# EAGLE design bitponics (EAGLE 6.4)
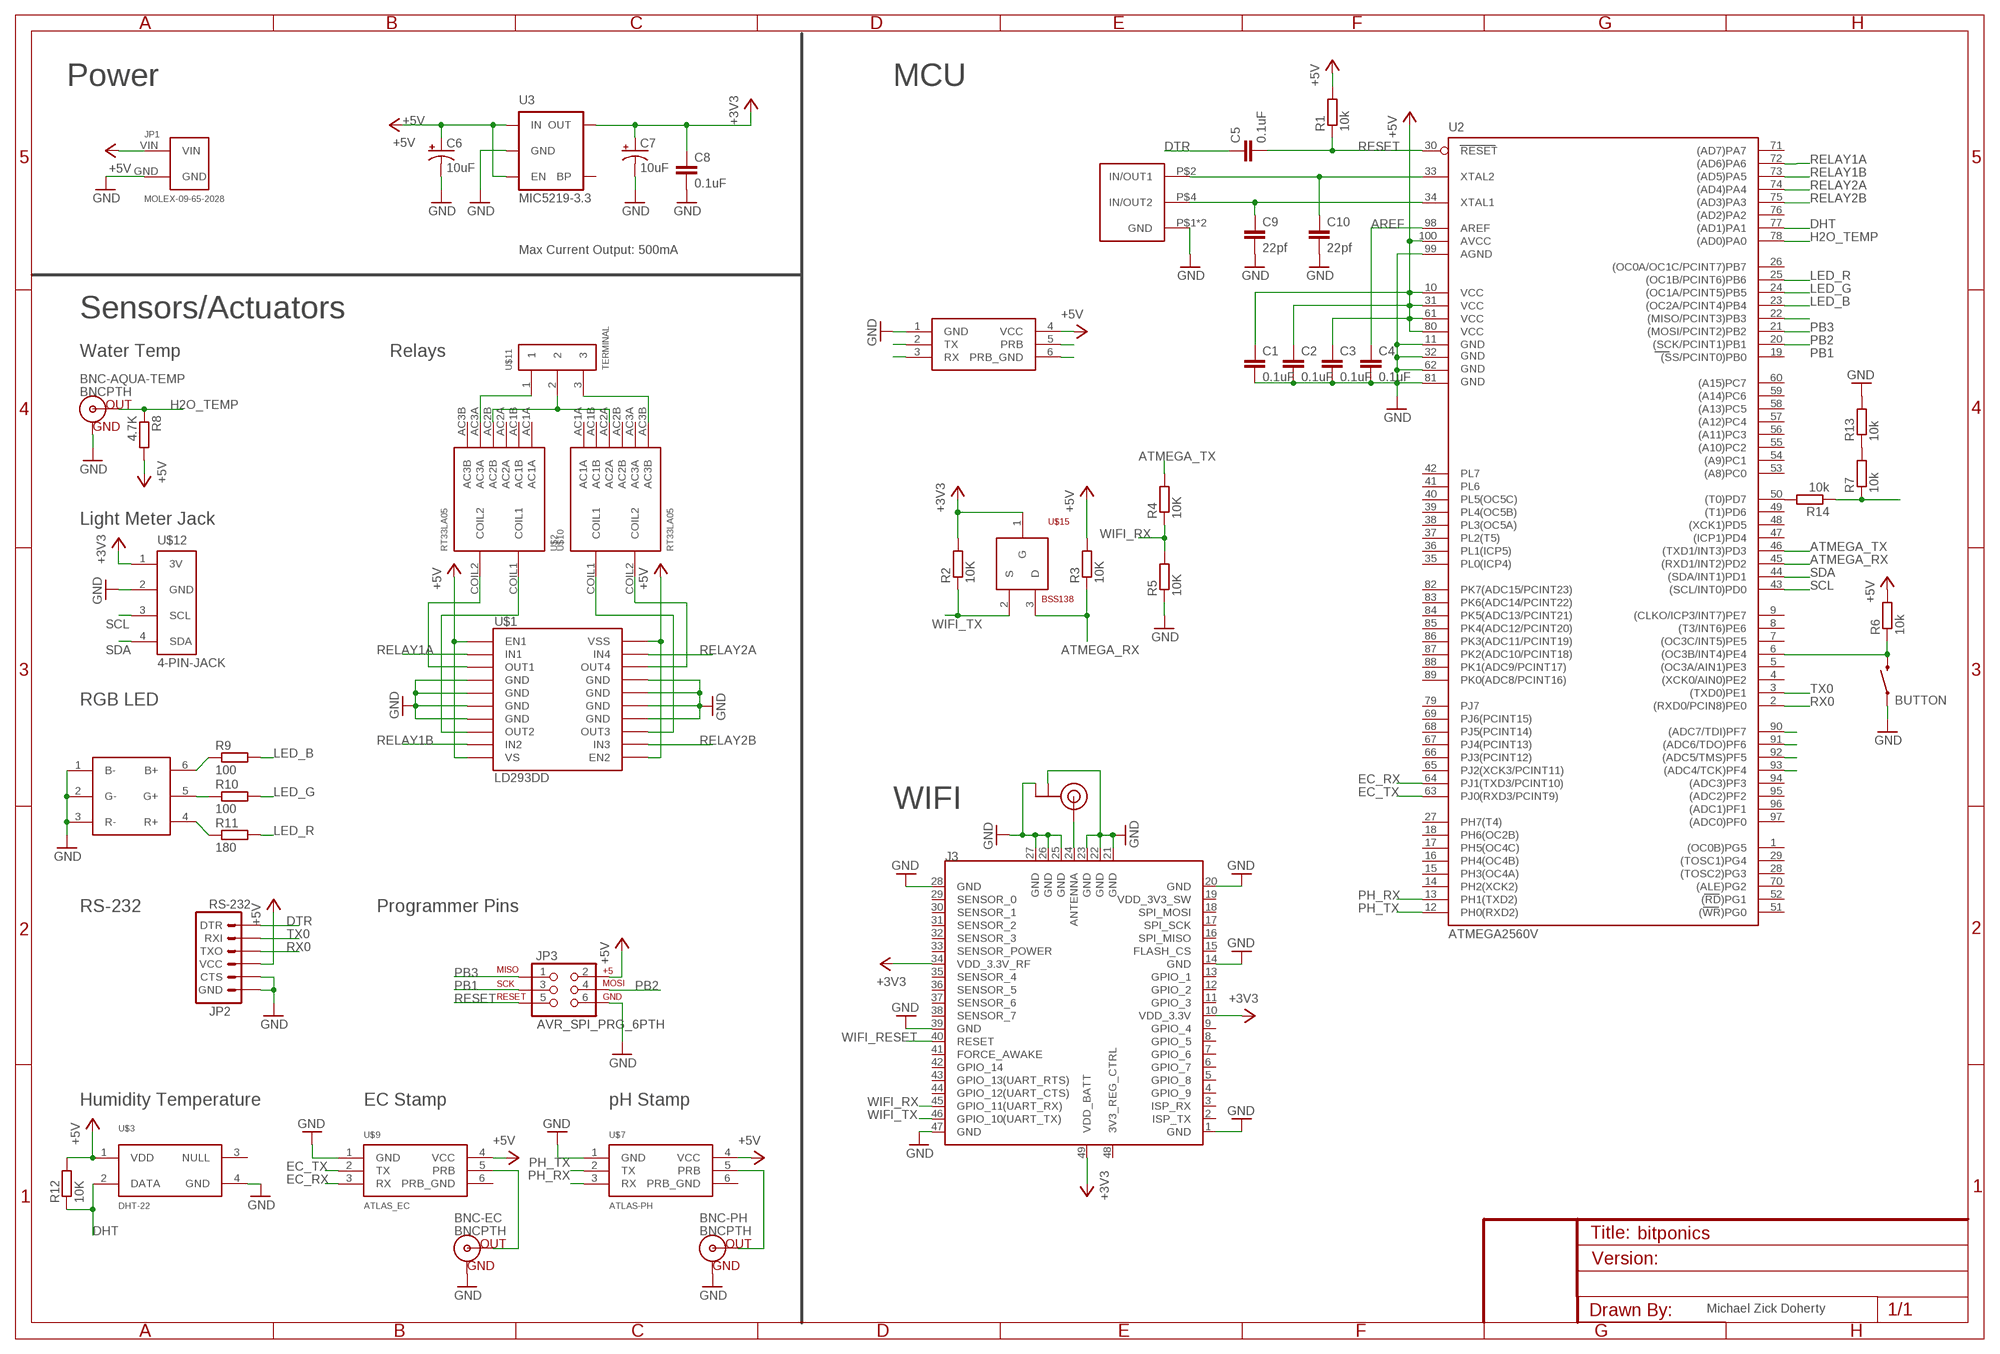
[diagram p0: schematic, sheet 1]

## Parts
BNC-AQUA-TEMP  BNCPTH  [BNC]
BNC-EC  BNCPTH  [BNC]
BNC-PH  BNCPTH  [BNC]
BUTTON  FSMRA2JH  [FSMRA2JH]
C1  0.1uF  C-EUC0603  [C0603]
C2  0.1uF  C-EUC0603  [C0603]
C3  0.1uF  C-EUC0603  [C0603]
C4  0.1uF  C-EUC0603  [C0603]
C5  0.1uF  C-EUC0603  [C0603]
C6  10uF  CAP_POL1206  [EIA3216]
C7  10uF  CAP_POL1206  [EIA3216]
C8  0.1uF  C-EUC0603  [C0603]
C9  22pf  C-EUC0603  [C0603]
C10  22pf  C-EUC0603  [C0603]
J3  WIFI-RN-171  [49P-1.27-26.67X17.78]
JP1  MOLEX-09-65-2028  [09-65-2028]
JP2  RS-232  ARDUINO_SERIAL_PROGRAMLOCK  [1X06_LOCK]
JP3  AVR_SPI_PRG_6PTH  [2X3]
R1  10k  R-EU_R0603  [R0603]
R2  10K  R-EU_R0603  [R0603]
R3  10K  R-EU_R0603  [R0603]
R4  10K  R-EU_R0603  [R0603]
R5  10K  R-EU_R0603  [R0603]
R6  10k  R-EU_R0603  [R0603]
R7  10k  R-EU_R0603  [R0603]
R8  4.7K  R-EU_R0603  [R0603]
R9  100  R-EU_R0603  [R0603]
R10  100  R-EU_R0603  [R0603]
R11  180  R-EU_R0603  [R0603]
R12  10K  R-EU_R0603  [R0603]
R13  10k  R-EU_R0603  [R0603]
R14  10k  R-EU_R0603  [R0603]
U2  ATMEGA2560AU  [TQFP100]
U3  V_REG_LDOSMD  [SOT23-5]
U13  RGB-LED  [RGB-LED]
U$1  LD293DD  [SO-20LD]
U$2  RT33LA05  [RT33LA05]
U$3  DHT-22  [DHT22]
U$4  ATLAS-PH  [PH]
U$5  U.FL  [U.FL]
U$6  ECX-32  [ECX-32]
U$7  ATLAS-PH  [PH]
U$9  ATLAS_EC  [EC]
U$10  RT33LA05  [RT33LA05]
U$11  TERMINAL  [TERMINAL]
U$12  4-PIN-JACK  [4-PIN-JACK]
U$15  BSS138  [SOT23]

## Nets
+3V3: C7.A(+) C8.1 J3.10(VDD_3.3V) J3.34(VDD_3.3V_RF) J3.49(VDD_BATT) R2.2 U3.5(OUT) U$12.1(3V) U$15.1(G)
+5V: C1.1 C2.1 C3.1 C6.A(+) JP1.VIN JP2.4(VCC) JP3.2 R1.2 R3.2 R6.2 R8.2 R12.2 U2.10(VCC) U2.31(VCC1) U2.61(VCC2) U2.80(VCC3) U2.100(AVCC) U3.1(IN) U3.3(EN) U$1.1(EN1) U$1.10(VS) U$1.11(EN2) U$1.20(VSS) U$3.1(VDD) U$4.4(VCC) U$7.4(VCC) U$9.4(VCC)
A4: U2.93((ADC4/TCK)PF4) U$4.5(PRB)
A5: U2.92((ADC5/TMS)PF5) U$4.6(PRB_GND)
A6: U2.91((ADC6/TDO)PF6) U$4.3(RX)
A7: U2.90((ADC7/TDI)PF7) U$4.2(TX)
AREF: C4.1 U2.98(AREF)
ATMEGA_RX: R3.1 U2.45((RXD1/INT2)PD2) U$15.3(D)
ATMEGA_TX: R4.2 U2.46((TXD1/INT3)PD3)
DHT: R12.1 U2.77((AD1)PA1) U$3.2(DATA)
DTR: C5.1 JP2.1(DTR)
EC_RX: U2.64(PJ1(TXD3/PCINT10)) U$9.3(RX)
EC_TX: U2.63(PJ0(RXD3/PCINT9)) U$9.2(TX)
GND: BNC-AQUA-TEMP.GND BNC-EC.GND BNC-PH.GND BUTTON.2A C1.2 C2.2 C3.2 C4.2 C6.C(-) C7.C(-) C8.2 C9.2 C10.2 J3.1(GND) J3.14(GND) J3.20(GND) J3.21(GND) J3.22(GND) J3.23(GND) J3.25(GND) J3.26(GND) J3.27(GND) J3.28(GND) J3.39(GND) J3.47(GND) JP1.GND JP2.5(CTS) JP2.6(GND) JP3.6 R5.1 R13.2 U2.11(GND) U2.32(GND1) U2.62(GND2) U2.81(GND3) U2.99(AGND) U3.2(GND) U13.1(B-) U13.2(G-) U13.3(R-) U$1.4(GND) U$1.5(GND) U$1.6(GND) U$1.7(GND) U$1.14(GND) U$1.15(GND) U$1.16(GND) U$1.17(GND) U$3.4(GND) U$4.1(GND) U$5.P$1(GND) U$5.P$2(GND) U$6.P$1(GND) U$6.P$3(GND) U$7.1(GND) U$9.1(GND) U$12.2(GND)
H2O_TEMP: BNC-AQUA-TEMP.S(OUT) R8.1 U2.78((AD0)PA0)
LED_B: R9.2 U2.23((OC2A/PCINT4)PB4)
LED_G: R10.2 U2.24((OC1A/PCINT5)PB5)
LED_R: R11.2 U2.25((OC1B/PCINT6)PB6)
N$1: BNC-EC.S(OUT) U$9.5(PRB)
N$2: BNC-PH.S(OUT) U$7.5(PRB)
N$3: U$1.13(OUT3) U$10.COIL1
N$4: U$2.AC3A U$11.1
N$5: U$2.AC2B U$10.AC2A U$11.2
N$6: U$10.AC3B U$11.3
N$7: C10.1 U2.33(XTAL2) U$6.P$2(IN/OUT1)
N$8: U$1.18(OUT4) U$10.COIL2
N$9: R10.1 U13.5(G+)
N$10: R11.1 U13.4(R+)
N$11: R9.1 U13.6(B+)
N$12: C9.1 U2.34(XTAL1) U$6.P$4(IN/OUT2)
N$13: J3.24(ANTENNA) U$5.P$3(SIGNAL)
N$16: U$1.3(OUT1) U$2.COIL2
N$17: U$1.8(OUT2) U$2.COIL1
N$18: R7.2 R13.1
N$19: R14.2 U2.50((T0)PD7)
N$22: BUTTON.2B R6.1 U2.6((OC3B/INT4)PE4)
PB1: JP3.3 U2.20((SCK/PCINT1)PB1)
PB2: JP3.4 U2.21((MOSI/PCINT2)PB2)
PB3: JP3.1 U2.22((MISO/PCINT3)PB3)
PH_RX: U2.13(PH1(TXD2)) U$7.3(RX)
PH_TX: U2.12(PH0(RXD2)) U$7.2(TX)
RELAY1A: U2.72((AD6)PA6) U$1.2(IN1)
RELAY1B: U2.73((AD5)PA5) U$1.9(IN2)
RELAY2A: U2.74((AD4)PA4) U$1.19(IN4)
RELAY2B: U2.75((AD3)PA3) U$1.12(IN3)
RESET: C5.2 JP3.5 R1.1 U2.30(RESET)
RX0: JP2.3(TXO) U2.2((RXD0/PCIN8)PE0)
SCL: U2.43((SCL/INT0)PD0) U$12.3(SCL)
SDA: U2.44((SDA/INT1)PD1) U$12.4(SDA)
TX0: JP2.2(RXI) U2.3((TXD0)PE1)
WIFI_RESET: J3.40(RESET) R7.1 R14.1
WIFI_RX: J3.45(GPIO_11(UART_RX)) R4.1 R5.2
WIFI_TX: J3.46(GPIO_10(UART_TX)) R2.1 U$15.2(S)
Unconnected: J3.2(ISP_TX) J3.3(ISP_RX) J3.4(GPIO_9) J3.5(GPIO_8) J3.6(GPIO_7) J3.7(GPIO_6) J3.8(GPIO_5) J3.9(GPIO_4) J3.11(GPIO_3) J3.12(GPIO_2) J3.13(GPIO_1) J3.15(FLASH_CS) J3.16(SPI_MISO) J3.17(SPI_SCK) J3.18(SPI_MOSI) J3.19(VDD_3V3_SW) J3.29(SENSOR_0) J3.30(SENSOR_1) J3.31(SENSOR_2) J3.32(SENSOR_3) J3.33(SENSOR_POWER) J3.35(SENSOR_4) J3.36(SENSOR_5) J3.37(SENSOR_6) J3.38(SENSOR_7) J3.41(FORCE_AWAKE) J3.42(GPIO_14) J3.43(GPIO_13(UART_RTS)) J3.44(GPIO_12(UART_CTS)) J3.48(3V3_REG_CTRL) U2.1((OC0B)PG5) U2.4((XCK0/AIN0)PE2) U2.5((OC3A/AIN1)PE3) U2.7((OC3C/INT5)PE5) U2.8((T3/INT6)PE6) U2.9((CLKO/ICP3/INT7)PE7) U2.14(PH2(XCK2)) U2.15(PH3(OC4A)) U2.16(PH4(OC4B)) U2.17(PH5(OC4C)) U2.18(PH6(OC2B)) U2.19((SS/PCINT0)PB0) U2.26((OC0A/OC1C/PCINT7)PB7) U2.27(PH7(T4)) U2.28((TOSC2)PG3) U2.29((TOSC1)PG4) U2.35(PL0(ICP4)) U2.36(PL1(ICP5)) U2.37(PL2(T5)) U2.38(PL3(OC5A)) U2.39(PL4(OC5B)) U2.40(PL5(OC5C)) U2.41(PL6) U2.42(PL7) U2.47((ICP1)PD4) U2.48((XCK1)PD5) U2.49((T1)PD6) U2.51((WR)PG0) U2.52((RD)PG1) U2.53((A8)PC0) U2.54((A9)PC1) U2.55((A10)PC2) U2.56((A11)PC3) U2.57((A12)PC4) U2.58((A13)PC5) U2.59((A14)PC6) U2.60((A15)PC7) U2.65(PJ2(XCK3/PCINT11)) U2.66(PJ3(PCINT12)) U2.67(PJ4(PCINT13)) U2.68(PJ5(PCINT14)) U2.69(PJ6(PCINT15)) U2.70((ALE)PG2) U2.71((AD7)PA7) U2.76((AD2)PA2) U2.79(PJ7) U2.82(PK7(ADC15/PCINT23)) U2.83(PK6(ADC14/PCINT22)) U2.84(PK5(ADC13/PCINT21)) U2.85(PK4(ADC12/PCINT20)) U2.86(PK3(ADC11/PCINT19)) U2.87(PK2(ADC10/PCINT18)) U2.88(PK1(ADC9/PCINT17)) U2.89(PK0(ADC8/PCINT16)) U2.94((ADC3)PF3) U2.95((ADC2)PF2) U2.96((ADC1)PF1) U2.97((ADC0)PF0) U3.4(BP) U$2.AC1A U$2.AC1B U$2.AC2A U$2.AC3B U$3.3(NULL) U$7.6(PRB_GND) U$9.6(PRB_GND) U$10.AC1A U$10.AC1B U$10.AC2B U$10.AC3A

## Notes on the sheet
- Power | MCU
- MIC5219-3.3
- Max Current Output: 500mA
- Sensors/Actuators
- Water Temp | Relays
- Light Meter Jack
- RGB LED
- WIFI
- RS-232 | Programmer Pins
- ATMEGA2560V
- Humidity Temperature | EC Stamp | pH Stamp
- Michael Zick Doherty

## Library data of the parts
BNC-AQUA-TEMP BNC-EC BNC-PH = SparkFun-Connectors:BNC: BNC Connector, Mouser Part# 5227161
BUTTON = bitponics:FSMRA2JH
C1-C5 C8-C10 = rcl:C-EU: CAPACITOR, European symbol
C6 C7 = SparkFun:CAP_POL: Capacitor Polarized These are standard SMD and PTH capacitors. Normally 10uF, 47uF, and 100uF in electrolytic and tantalum varieties. Always verify the external diameter of the through hole cap, it varies with capacity, voltage, and manufacturer. The EIA devices should be standard.
J3 = Seeed-Module:WIFI-RN-171: WIFLY GSX 802.11 b/g wireless LAN Module
JP1 = bitponics:MOLEX-09-65-2028
JP2 = SparkFun:ARDUINO_SERIAL_PROGRAM
JP3 = SparkFun:AVR_SPI_PRG_6: AVR ISP 6 Pin This is the reduced ISP connector for AVR programming. Common on Arduino. This footprint will take up less PCB space and can be used with a 10-pin to 6-pin adapter such as SKU: BOB-08508
R1-R14 = rcl:R-EU_: RESISTOR, European symbol
U2 = SparkFun:ATMEGA2560: MICROCONTROLLER 64/128/256 Kbytes FLASH 4 Kbytes EEPROM 8 Kbytes SRAM 86 General Purpose I/O pins 12-channels16-bit PWM 4 x Serial USARTs 16-channels 10-bit A/D
U3 = SparkFun:V_REG_LDO: Voltage Regulator LDO Standard 150mA LDO voltage regulator in SOT-23 layout. Micrel part MIC5205. BP (by-pass) pin is used to lower output noise with 470pF cap.
U13 = bitponics:RGB-LED
U$1 = bitponics:LD293DD
U$2 U$10 = bitponics:RT33LA05
U$3 = bitponics:DHT-22
U$4 U$7 = bitponics:ATLAS-PH
U$5 = SparkFun-Connectors:U.FL: SMD antenna connector- WRL-09144
U$6 = bitponics:ECX-32
U$9 = bitponics:ATLAS_EC
U$11 = bitponics:TERMINAL
U$12 = bitponics:4-PIN-JACK
U$15 = bitponics:BSS138

## Net classes
0 default: width 0.003 mm, drill 0.254 mm, clearance 0.152 mm

## Board
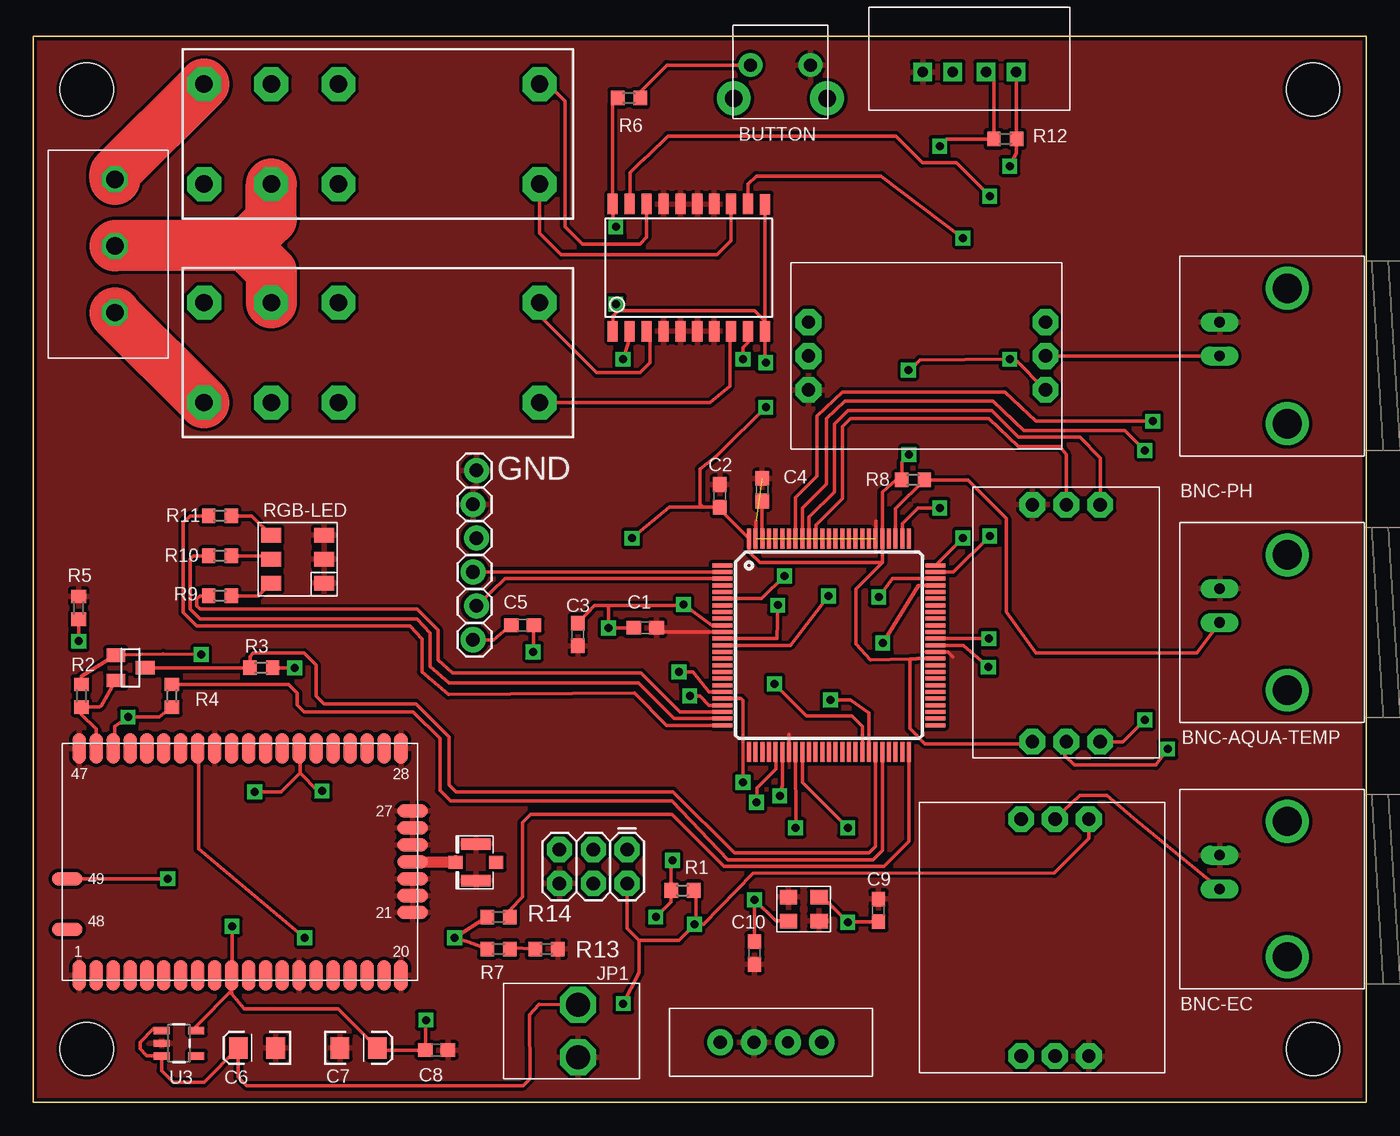
[diagram p1: board, top side]
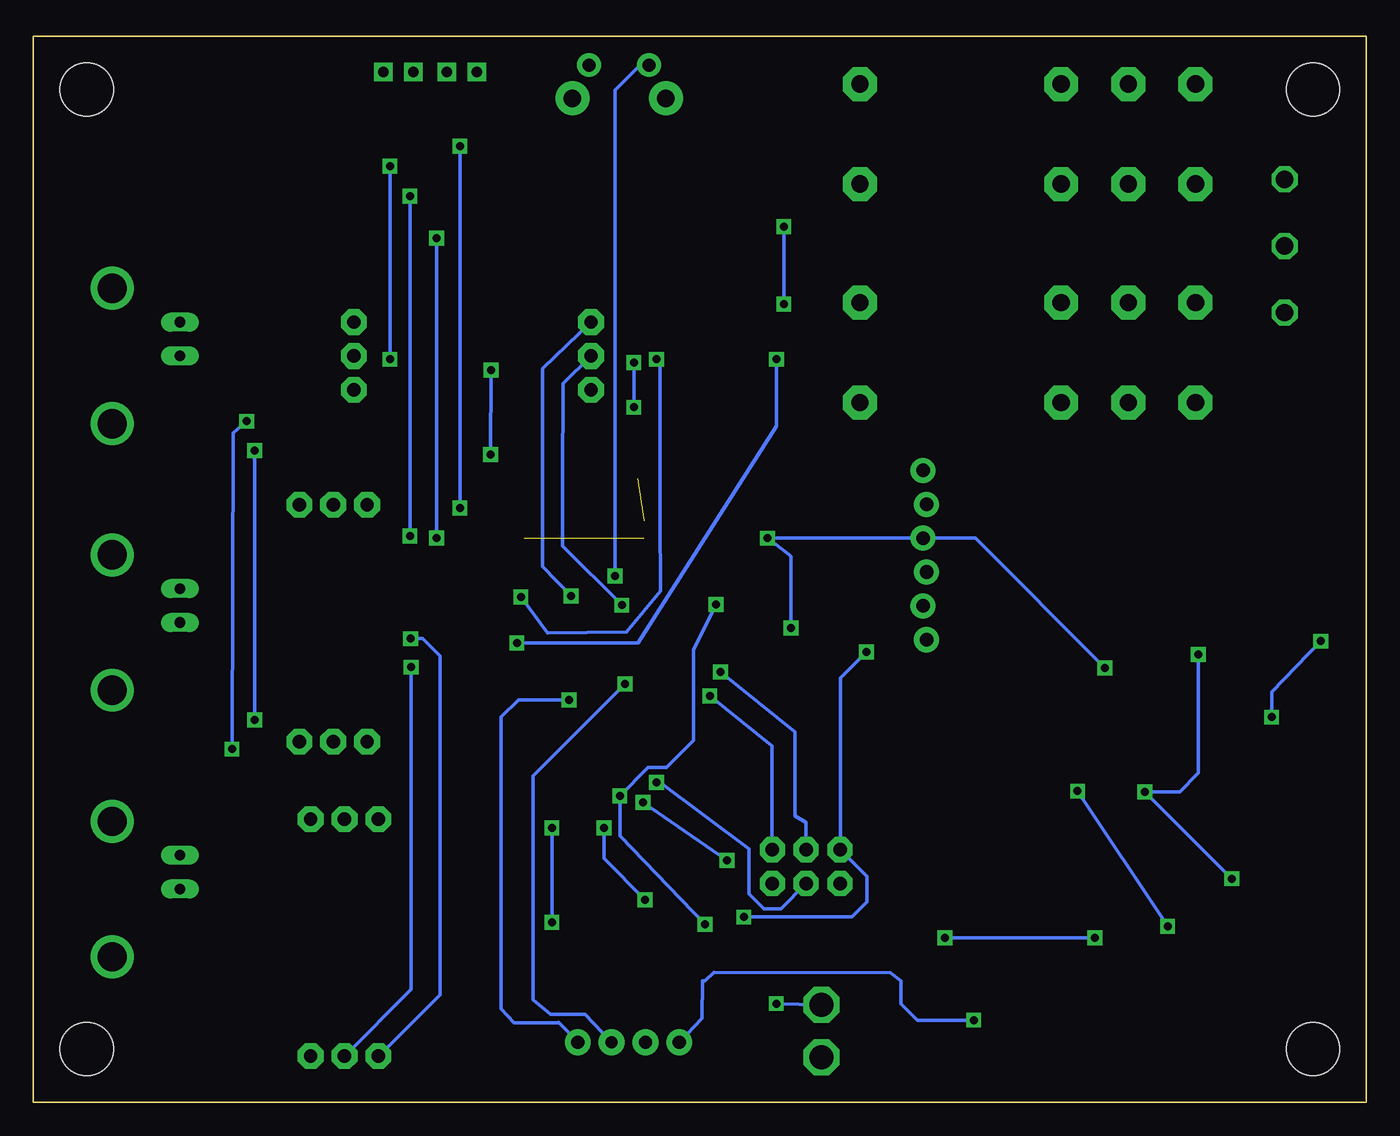
[diagram p2: board, bottom side, seen from below]

Size 100 x 80 mm. Coordinates in mm from the lower left corner, seen from the top.
Outline: 0,0 0,80 100,80 100,0 0,0
Copper layers (1*16): Top 0.035mm / dielectric 1.5mm / Bottom 0.035mm
Design rules "default": minimum track width 8mil, minimum drill 20mil, track to track 8mil, track to pad 8mil, pad to pad 8mil, via to via 8mil, smd to smd 8mil, copper to edge 8mil, drill to drill 8mil, minimum pad ring 12mil, minimum via ring 10mil, stop-mask expansion 4mil, vias tented up to drill 20mil, thermal gap 10mil
Holes 4 mm at 96,76 4,76 4,4 96,4

### Footprints (pad centres in the part's own frame; a part is rotated, then mirrored left to right if it is on the bottom)
BNC = drill 2.2: 3 -5.08,5.08; 4 5.08,5.08 | drill 0.8 long: GND -2.54,0; S 0,0
FSMRA2JH = drill 1.3 pad 2.54: 1A -3.505,1.245; 1B 3.505,1.245 | drill 0.99 pad 1.778: 2A -2.25,-1.245; 2B 2.25,-1.245
C0603 = smd 1.1 x 1: 1 -0.85,0; 2 0.85,0
EIA3216 = smd 1.4 x 1.6: A 1.4,0; C -1.4,0
49P-1.27-26.67X17.78 = smd 1.016 x 2.286: 1 12.065,8.509; 2 10.795,8.509; 3 9.525,8.509; 4 8.255,8.509; 5 6.985,8.509; 6 5.715,8.509; 7 4.445,8.509; 8 3.175,8.509; 9 1.905,8.509; 10 0.635,8.509; 11 -0.635,8.509; 12 -1.905,8.509; 13 -3.175,8.509; 14 -4.445,8.509; 15 -5.715,8.509; 16 -6.985,8.509; 17 -8.255,8.509; 18 -9.525,8.509; 19 -10.795,8.509; 20 -12.065,8.509; 28 -12.065,-8.509; 29 -10.795,-8.509; 30 -9.525,-8.509; 31 -8.255,-8.509; 32 -6.985,-8.509; 33 -5.715,-8.509; 34 -4.445,-8.509; 35 -3.175,-8.509; 36 -1.905,-8.509; 37 -0.635,-8.509; 38 0.635,-8.509; 39 1.905,-8.509; 40 3.175,-8.509; 41 4.445,-8.509; 42 5.715,-8.509; 43 6.985,-8.509; 44 8.255,-8.509; 45 9.525,-8.509; 46 10.795,-8.509; 47 12.065,-8.509 | smd 2.286 x 1.016: 21 -12.954,3.81; 22 -12.954,2.54; 23 -12.954,1.27; 24 -12.954,0; 25 -12.954,-1.27; 26 -12.954,-2.54; 27 -12.954,-3.81; 48 12.954,5.08; 49 12.954,1.27
09-65-2028 = drill 1.8 octagon: GND 1.98,0.5; VIN -1.98,0.5
1X06_LOCK = drill 1.016 pad 1.88: 1 0,0; 2 2.54,-0.254; 3 5.08,0; 4 7.62,-0.254; 5 10.16,0; 6 12.7,-0.254
2X3 = drill 1.016 pad 1.88 octagon: 1 0,0; 2 0,2.54; 3 2.54,0; 4 2.54,2.54; 5 5.08,0; 6 5.08,2.54
R0603 = smd 1 x 1.1: 1 -0.85,0; 2 0.85,0
TQFP100 = smd 1.5 x 0.3: 1 -8,6; 2 -8,5.5; 3 -8,5; 4 -8,4.5; 5 -8,4; 6 -8,3.5; 7 -8,3; 8 -8,2.5; 9 -8,2; 10 -8,1.5; 11 -8,1; 12 -8,0.5; 13 -8,0; 14 -8,-0.5; 15 -8,-1; 16 -8,-1.5; 17 -8,-2; 18 -8,-2.5; 19 -8,-3; 20 -8,-3.5; 21 -8,-4; 22 -8,-4.5; 23 -8,-5; 24 -8,-5.5; 25 -8,-6; 51 8,-6; 52 8,-5.5; 53 8,-5; 54 8,-4.5; 55 8,-4; 56 8,-3.5; 57 8,-3; 58 8,-2.5; 59 8,-2; 60 8,-1.5; 61 8,-1; 62 8,-0.5; 63 8,0; 64 8,0.5; 65 8,1; 66 8,1.5; 67 8,2; 68 8,2.5; 69 8,3; 70 8,3.5; 71 8,4; 72 8,4.5; 73 8,5; 74 8,5.5; 75 8,6 | smd 0.3 x 1.5: 26 -6,-8; 27 -5.5,-8; 28 -5,-8; 29 -4.5,-8; 30 -4,-8; 31 -3.5,-8; 32 -3,-8; 33 -2.5,-8; 34 -2,-8; 35 -1.5,-8; 36 -1,-8; 37 -0.5,-8; 38 0,-8; 39 0.5,-8; 40 1,-8; 41 1.5,-8; 42 2,-8; 43 2.5,-8; 44 3,-8; 45 3.5,-8; 46 4,-8; 47 4.5,-8; 48 5,-8; 49 5.5,-8; 50 6,-8; 76 6,8; 77 5.5,8; 78 5,8; 79 4.5,8; 80 4,8; 81 3.5,8; 82 3,8; 83 2.5,8; 84 2,8; 85 1.5,8; 86 1,8; 87 0.5,8; 88 0,8; 89 -0.5,8; 90 -1,8; 91 -1.5,8; 92 -2,8; 93 -2.5,8; 94 -3,8; 95 -3.5,8; 96 -4,8; 97 -4.5,8; 98 -5,8; 99 -5.5,8; 100 -6,8
SOT23-5 = smd 0.55 x 1.2: 1 -0.95,-1.3; 2 0,-1.3; 3 0.95,-1.3; 4 0.95,1.3; 5 -0.95,1.3
RGB-LED = smd 1.5 x 1.1: 1 -2,1.8; 2 -2,0; 3 -2,-1.8; 4 2,-1.8; 5 2,0; 6 2,1.8
SO-20LD = smd 0.762 x 1.524: 1 -5.715,-4.775; 2 -4.445,-4.775; 3 -3.175,-4.775; 4 -1.905,-4.775; 5 -0.635,-4.775; 6 0.635,-4.775; 7 1.905,-4.775; 8 3.175,-4.775; 9 4.445,-4.775; 10 5.715,-4.775; 11 5.715,4.75; 12 4.445,4.775; 13 3.175,4.775; 14 1.905,4.775; 15 0.635,4.775; 16 -0.635,4.775; 17 -1.905,4.775; 18 -3.175,4.775; 19 -4.445,4.775; 20 -5.715,4.775
RT33LA05 = drill 1.3 pad 2.54 octagon: AC1A 3.11,3.75; AC1B 3.11,-3.75; AC2A 8.15,3.75; AC2B 8.15,-3.75; AC3A 13.19,3.75; AC3B 13.19,-3.75; COIL1 -11.98,3.75; COIL2 -11.98,-3.75
DHT22 = drill 0.8 square: 1 -3.5,1; 2 -1.25,1; 3 1.25,1; 4 3.5,1
PH = drill 1 pad 1.93 octagon: 1 -2.54,8.839; 2 0,8.839; 3 2.54,8.839; 4 -2.54,-8.941; 5 0,-8.941; 6 2.54,-8.941
U.FL = smd 2.2 x 0.85: P$1 0,1.375; P$2 0,-1.375 | smd 1.05 x 1: P$3 1.525,0; P$4 -1.525,0
ECX-32 = smd 1.3 x 1.1: P$1 -1.15,0.9; P$2 1.15,0.9; P$3 1.15,-0.9; P$4 -1.15,-0.9
EC = drill 1 pad 1.93 octagon: 1 -3.493,8.89; 2 -0.953,8.89; 3 1.587,8.89; 4 -3.493,-8.89; 5 -0.953,-8.89; 6 1.587,-8.89
TERMINAL = drill 1.3 pad 1.93 octagon: 1 -0.5,4.4; 2 -0.5,-0.6; 3 -0.5,-5.6
4-PIN-JACK = drill 1 pad 1.93: 1 0,3.81; 2 0,1.27; 4 0,-3.81 | drill 0.9 pad 1.93: 3 0,-1.27
SOT23 = smd 1 x 1.4: 1 -0.95,-1.1; 2 0.95,-1.1; 3 0,1.1

### Placement (x,y rotation side)
BNC-AQUA-TEMP  89,36 270 top
BNC-EC  89,16 270 top
BNC-PH  89,56 270 top
BUTTON  56.05,76.58 180 top
C1  45.9,35.6 0 top
C2  51.5,45.5 90 top
C3  40.85,35.1 270 top
C4  54.69,45.97 90 top
C5  36.7,35.8 0 top
C6  16.78,4.08 180 top
C7  24.4,4.08 0 top
C8  30.25,3.92 0 top
C9  63.4,14.4 90 top
C10  54.1,11.2 270 top
J3  15.51,18.05 180 top
JP1  40.38,5.35 270 top
JP2  32.99,34.71 90 top
JP3  44.56,18.96 180 top
R1  48.7,15.9 0 top
R2  3.6,30.5 90 top
R3  17.1,32.6 0 top
R4  10.4,30.5 90 top
R5  3.4,37.1 270 top
R6  44.69,75.36 180 top
R7  34.9,11.5 0 top
R8  66,46.7 180 top
R9  14,38 180 top
R10  14,41 180 top
R11  14,44 180 top
R12  72.92,72.29 0 top
R13  38.5,11.5 0 top
R14  34.9,13.9 0 top
U2  59.69,34.29 0 top
U3  10.92,4.43 270 top
U13  19.83,40.75 180 top
U$1  49.18,62.63 0 top
U$2  26,56.25 180 top
U$3  70.23,78.31 180 top
U$4  77.5,36 0 top
U$5  33.2,18 180 top
U$6  57.8,14.5 180 top
U$7  67,56 90 top
U$9  75.7,12.36 180 top
U$10  26,72.65 180 top
U$11  5.62,63.65 180 top
U$12  55.34,4.51 90 top
U$15  7.29,32.6 270 top

### Tracks (layer width: path | path; a pad name or v marks a point on that pad's centre or on a via)
+3V3  (via drill 0.6)
  Top 0.254: U3.5 12.22,5.72 15,8.5 15,9.42 J3.10 | J3.10 14.88,8.12 15.8,7 22.88,7 C7.A 25.96,3.92 C8.1 v29.45,6.17 | R2.2 3.6,31.96 U$15.1 9.75,33.65 v12.6,33.6 | v16.6,23.3 18.6,23.3 20,24.7 | 20,24.7 20,26.51 J3.34 20,26.6 20,27.1 | v14.9,13.2 14.9,9.57 J3.10 | J3.49 v10.08,16.78 | v21.66,23.36 21.34,23.36 20,24.7
  Bottom 0.254: v29.45,6.17 33.67,6.17 34.9,7.4 34.9,9.1 35.7,9.7 48.92,9.77 49.59,9.1 49.8,9.1 49.84,6.3 U$12.1 | v12.6,33.6 12.6,24.7 14,23.3 v16.6,23.3 v10.08,16.78 | v21.66,23.36 v14.9,13.2
+5V  (via drill 0.6)
  Top 0.254: U$9.4 79.19,19.79 76.6,17.2 53.98,17.17 50.26,13.35 49.65,13.35 | U2.31 56.19,23.81 v56,23 | U3.1 9.5,5.5 9,5.5 8,4.5 8,4 8.52,3.48 U3.3 9.62,2.38 10.5,1.5 12.8,1.5 C6.A 15.38,1.87 16,1.25 36.75,1.25 37.25,1.75 37.23,6.55 37.95,7.35 JP1.VIN | U$3.1 73.77,77.27 R12.2 73.77,71.27 v73.25,70.25 | JP3.2 44.56,13.04 45.45,12.15 | 45.45,12.15 48.45,12.15 49.65,13.35 | 49.65,13.35 49.7,13.4 49.7,15.75 R1.2 | 50.25,44.65 C2.1 51.5,44.48 U2.100 53.69,41.31 54.5,40.5 63.69,40.5 | 50.25,44.65 47.74,44.65 v44.92,42.33 | 63.69,40.5 U2.80 63.69,43.09 63.7,43.9 63.7,45.8 64.7,46.7 R8.2 65.15,48.05 v65.7,48.6 | 63.69,40.5 61.7,38.51 61.7,34.4 62.79,33.21 65.75,33.25 | R6.2 43.47,74.98 U$1.20 43.5,67.37 43.5,65.9 v43.7,65.7 | U$7.4 73.65,55.75 v73.25,55.75 66.5,55.7 65.75,54.95 v65.65,54.95 | C3.1 42.1,37.3 43.1,37.3 | U$1.10 U$1.11 | U$1.10 54.9,55.85 v54.95,55.5 | v54.95,52.15 51.5,48.75 51.25,48.5 50,47.5 50,44.9 50.25,44.65 | U$1.1 43.5,57.89 43.5,59 43.9,59.4 | 43.9,59.4 54.1,59.4 54.9,58.6 U$1.10 | v43.7,59.9 43.9,59.7 43.9,59.4 | v49.6,13.35 49.65,13.35 | R3.2 v19.6,32.6 | v19.6,32.6 19.7,32.6 | 19.7,32.5 v19.6,32.6 | C1.1 v43.15,35.6 43.15,37.25 43.1,37.3 | U2.10 50.94,35.79 v48.77,37.35 48.72,37.3 43.1,37.3 | U$4.4 74.8,26.9 66.9,26.9 65.75,28.05 65.75,33.25 | U2.61 66.3,33.3 66.25,33.25 65.75,33.25 | 45.45,12.15 45.45,9.71 v44.26,7.41
  Bottom 0.254: v49.6,13.35 56,20 v56,23 53.88,25.12 52.5,25.12 50.48,27.15 50.48,33.92 v48.77,37.35 | v43.15,35.6 43.15,40.95 43.3,41.1 v44.92,42.33 JP2.4 29.33,42.33 v19.6,32.6 | v44.26,7.41 JP1.VIN | v73.25,70.25 v73.25,55.75 | v54.95,55.5 v54.95,52.15 | v65.7,48.6 v65.65,54.95 | v43.7,65.7 v43.7,59.9
A4  (via drill 0.6)
  Top 0.254: U2.93 57.19,45.39 58.8,47 58.8,51.5 60.7,53.3 72.9,53.3 75.2,51.1 v84,51.1 | v85.1,26.5 84.2,25.3 78.1,25.3 77.4,26 77.4,26.96 U$4.5
  Bottom 0.254: v84,51.1 85,50.2 v85.1,26.5
A5  (via drill 0.6)
  Top 0.254: U$4.6 81.76,27.06 v83.4,28.7 | v83.4,48.9 81.9,50.4 74.3,50.4 72,52.6 60.9,52.6 59.5,51.3 59.5,46.4 57.7,44.6 U2.92
  Bottom 0.254: v83.4,28.7 v83.4,48.9
A6
  Top 0.254: U2.91 58.2,43.9 60.1,45.8 60.1,50.9 61.1,51.9 71.9,51.9 73.9,49.9 78.5,49.9 80.04,48.36 U$4.3
A7
  Top 0.254: U2.90 58.7,43.3 60.7,45.3 60.7,50.7 61.3,51.3 71.7,51.3 73.9,49.2 77,49.2 77.5,48.6 U$4.2
AREF
  Top 0.254: U2.98 C4.1
ATMEGA_RX
  Top 0.254: U$15.3 R3.1 16.25,33.45 16.5,33.7 20.3,33.7 21.2,32.8 21.2,30.5 21.8,29.9 28.7,29.9 31.2,27.4 31.2,23.8 31.7,23.3 48,23.3 52.6,18.7 62.7,18.7 63.19,19.19 U2.45
ATMEGA_TX
  Top 0.254: R4.2 19.15,31.35 19.8,30.7 19.8,29.8 20.3,29.3 28.5,29.3 30.5,27.3 30.5,23.4 31.3,22.6 47.9,22.6 52.1,18.2 63,18.2 63.7,18.9 U2.46
DHT  (via drill 0.6)
  Top 0.254: U$3.2 72.07,76.72 R12.1 72.03,72.25 68.5,72.25 v68,71.75 | U2.77 65.19,43.44 66.35,44.6 v68,44.6
  Bottom 0.254: v68,44.6 v68,71.75
DTR
  Top 0.254: JP2.1 34.54,34.71 C5.1
EC_RX  (via drill 0.6)
  Top 0.254: U2.64 v71.69,34.79
  Bottom 0.254: v71.69,34.79 70.79,34.79 69.5,33.5 69.5,8.08 U$9.3
EC_TX  (via drill 0.6)
  Top 0.254: U2.63 69.79,34.29 v71.65,32.65
  Bottom 0.254: v71.65,32.65 71.65,8.47 U$9.2
GND  (2 unrouted)
  Top 0.254: 56.7,27.6 U2.32 | 54.2,43.6 U2.99 | 69,33.4 68.6,33.8 U2.62 | 63.2,43.6 63.2,42.2 63.19,42.21 U2.81 | 51.2,35.3 51.21,35.29 U2.11 51.79,35.29 51.8,35.3 | 52,35.3 51.8,35.3 | 51.8,35.3 47.05,35.3 C1.2
  pour Top (isolate 0.254): 100,80 100,0 0,0 0,80
H2O_TEMP
  Top 0.254: U2.78 64.69,44.54 R8.1 70.1,46.7 73,43.8 73,36.8 75.2,33.7 87.3,33.7 BNC-AQUA-TEMP.S
LED_B
  Top 0.254: R9.2 12.5,38 12.25,37.75 12.25,37.25 12.5,37 28.8,37 30.35,35.45 30.35,33.2 31.45,32.2 45.6,32.2 48.51,29.29 U2.23
LED_G
  Top 0.254: R10.2 12,41 11.75,40.75 11.75,37 12.5,36.25 28.8,36.25 29.75,35.2 29.75,32.7 31.2,31.45 45.4,31.45 48.06,28.79 U2.24
LED_R
  Top 0.254: R11.2 11.75,44 11.25,43.5 11.25,36.75 12.25,35.75 28.25,35.75 29.15,34.75 29.15,32.3 31.15,30.6 45.1,30.7 47.51,28.29 U2.25
N$1
  Top 0.254: U$9.5 78.52,23.05 80.55,23.05 82.8,21.1 BNC-EC.S
N$2
  Top 0.254: U$7.5 BNC-PH.S
N$3
  Top 0.254: U$1.13 52.35,65.5 52.35,64.65 51.3,63.6 39.6,63.6 37.98,65.22 U$10.COIL1
N$4
  Top 3.81: U$11.1 6.12,59.19 U$2.AC3A
N$5
  Top 3.81: U$11.2 6.17,64.3 15.9,64.3 | 15.9,64.3 17.85,66.25 U$10.AC2A | 15.9,64.3 17.85,62.35 U$2.AC2B
N$6
  Top 3.81: U$11.3 6.12,69.71 U$10.AC3B
N$7  (via drill 0.6)
  Top 0.254: U2.33 v57.2,20.6 v57.19,20.59 | C10.1 v54.1,15.2 55.7,13.6 U$6.P$2
  Bottom 0.254: v57.19,20.59 57.19,18.29 v54.1,15.2
N$8
  Top 0.254: U$1.18 46,64.9 45.5,64.4 41.2,64.4 39.9,65.7 39.9,75.1 38.6,76.4 U$10.COIL2
N$9
  Top 0.254: R10.1 17.58,41 U13.5
N$10
  Top 0.254: R11.1 16.38,44 U13.4
N$11
  Top 0.254: R9.1 16.88,38 U13.6
N$12  (via drill 0.6)
  Top 0.254: U2.34 57.69,24.01 v61.1,20.6 | C9.1 61.15,13.55 v61.1,13.5 59.2,15.4 U$6.P$4
  Bottom 0.254: v61.1,20.6 v61.1,13.5
N$13
  Top 0.813: J3.24 31.68,18.05
  Top 1.016: 31.68,18.05 U$5.P$3
N$16
  Top 0.254: U$2.COIL2 37.98,59.02 42.25,54.75 45.5,54.75 46.25,55.5 46.25,57.61 U$1.3
N$17
  Top 0.254: U$2.COIL1 50.75,52.5 52.25,53.75 52.25,57.75 U$1.8
N$18
  Top 0.254: R13.1 35.85,11.6 R7.2
N$19
  Top 0.254: R14.2 35.75,14.45 36.7,15.4 36.7,21 37.3,21.6 47.9,21.6 51.8,17.7 63.8,17.7 65.69,19.59 U2.50
N$22  (via drill 0.6)
  Top 0.254: R6.1 45.54,75.84 47.52,77.83 BUTTON.2B | v56.35,39.5 54.64,37.79 U2.6
  Bottom 0.254: BUTTON.2B 54.48,77.83 56.35,75.95 v56.35,39.5
PB1  (via drill 0.6)
  Top 0.254: v48.45,32.3 49.5,32.3 50.71,30.79 U2.20
  Bottom 0.254: v48.45,32.3 42.85,27.8 42.85,21.48 42.02,21.01 JP3.3
PB2  (via drill 0.6)
  Top 0.254: v53.25,24 53.25,30.15 53.11,30.29 U2.21
  Bottom 0.254: v53.25,24 53,24 46.33,19.02 46.33,15.65 45.2,14.53 43.91,14.53 JP3.4
PB3  (via drill 0.6)
  Top 0.254: v49.25,30.5 50,30.5 50.71,29.79 U2.22
  Bottom 0.254: v49.25,30.5 44.6,26.75 44.6,19.62 JP3.1
PH_RX  (via drill 0.6)
  Top 0.254: U2.13 56.79,34.29 v59.65,38
  Bottom 0.254: v59.65,38 61.8,40.2 61.8,55.03 61.75,55.08 U$7.3
PH_TX  (via drill 0.6)
  Top 0.254: U2.12 55.79,34.79 v55.85,37.3
  Bottom 0.254: v55.85,37.3 60.3,41.75 60.3,46.5 60.25,53.91 U$7.2
RELAY1A  (via drill 0.6)
  Top 0.254: U$1.2 44.73,57.27 v44.25,55.75 | U2.72 66.42,38.79 v63.73,34.48
  Bottom 0.254: v44.25,55.75 44.25,50.75 54.65,34.48 v63.73,34.48
RELAY1B  (via drill 0.6)
  Top 0.254: U2.73 64.46,39.29 v63.42,37.92 | U$1.9 53.62,57 53.25,56.62 v53.25,55.75
  Bottom 0.254: v63.42,37.92 61.42,35.23 55.5,35.27 52.95,38.38 53,44 53,55.38 v53.25,55.75
RELAY2A  (via drill 0.6)
  Top 0.254: U2.74 69.04,39.79 v71.75,42.5 | v71.75,68 69.25,70.5 66.7,70.5 64.7,72.5 47.6,72.5 46.2,71.1 45.5,70.5 44.75,69.75 44.75,67.42 U$1.19
  Bottom 0.254: v71.75,42.5 v71.75,68
RELAY2B  (via drill 0.6)
  Top 0.254: U$1.12 53.62,68.88 54.25,69.5 63.6,69.5 v69.75,64.85 | v69.75,42.35 U2.75
  Bottom 0.254: v69.75,64.85 v69.75,42.35
RESET  (via drill 0.6)
  Top 0.254: v54.25,22.5 54.29,22.54 54.29,23.59 55.7,25 U2.30 | v47.95,18.15 47.85,18.05 R1.1 47.85,15.05 v46.7,13.9 | v37.5,33.8 C5.2
  Bottom 0.254: v54.25,22.5 v47.95,18.15 | v37.5,33.8 38.99,32.29 | 38.99,32.29 39.38,31.9 | v46.7,13.9 38.58,13.9 37.45,15.03 37.45,16.94 JP3.5 39.45,18.99 39.45,31.83 38.99,32.29
RX0
  Top 0.254: U2.2 JP2.3
SCL  (via drill 0.6)
  Top 0.254: v55.6,31.4 58,29 61.4,29 62.2,28.2 U2.43
  Bottom 0.254: U$12.3 58.6,6.6 58.6,6.59 61.19,6.59 62.5,7.7 62.5,24.5 v55.6,31.4
SDA  (via drill 0.6)
  Top 0.254: U2.44 62.7,29.2 61.3,30.2 v59.8,30.2
  Bottom 0.254: v59.8,30.2 63.6,30.2 64.9,28.9 64.9,7 63.95,5.95 60.6,5.95 60.6,6 U$12.4
TX0
  Top 0.254: U2.3 35.38,39.29 JP2.2
WIFI_RESET  (via drill 0.6)
  Top 0.254: 12,26.22 12,26.89 J3.40 12.4,26.49 12.4,19 v20.35,12.35 | R14.1 v31.6,12.35 32.6,12.05 R7.1
  Bottom 0.254: v20.35,12.35 v31.6,12.35
WIFI_RX  (via drill 0.6)
  Top 0.254: 6,26.57 J3.45 6.1,26.67 6.1,28.2 v7.1,28.9 9.45,28.9 R4.1 | v3.4,34.6 R5.2
  Bottom 0.254: v3.4,34.6 7.1,30.8 v7.1,28.9
WIFI_TX
  Top 0.254: 4.6,26.67 J3.46 4.7,26.57 4.7,28 3.6,29.1 R2.1 4.95,29.65 5,29.7 5.1,29.76 U$15.2

### Text on the board
tNames: GND